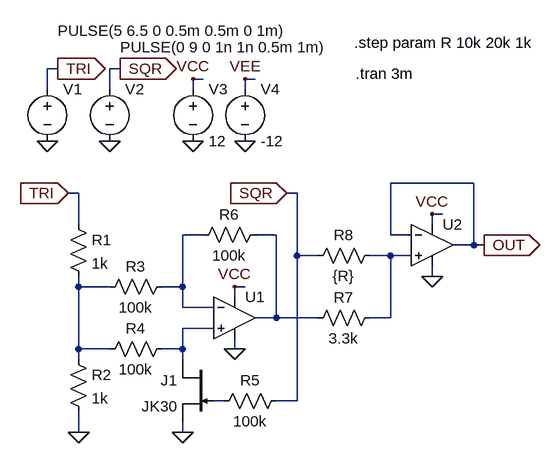
[diagram p0: schematic TRI_SQR_to_SAW_01.asc]
TRI_SQR_to_SAW_01.asc, the LTspice schematic file:
Version 4
SHEET 1 1268 680
WIRE 112 -160 96 -160
WIRE 208 -160 192 -160
WIRE 336 -144 320 -144
WIRE 416 -144 400 -144
WIRE 96 -128 96 -160
WIRE 192 -128 192 -160
WIRE 320 -128 320 -144
WIRE 400 -128 400 -144
WIRE 752 16 624 16
WIRE 144 32 128 32
WIRE 480 32 464 32
WIRE 704 64 688 64
WIRE 144 80 144 32
WIRE 688 80 688 64
WIRE 336 96 304 96
WIRE 448 96 416 96
WIRE 624 96 624 16
WIRE 656 96 624 96
WIRE 752 112 752 16
WIRE 752 112 720 112
WIRE 768 112 752 112
WIRE 480 128 480 32
WIRE 512 128 480 128
WIRE 624 128 592 128
WIRE 656 128 624 128
WIRE 688 160 688 144
WIRE 144 176 144 160
WIRE 192 176 144 176
WIRE 304 176 304 96
WIRE 304 176 272 176
WIRE 400 176 384 176
WIRE 384 192 384 176
WIRE 304 208 304 176
WIRE 352 208 304 208
WIRE 448 224 448 96
WIRE 448 224 416 224
WIRE 512 224 448 224
WIRE 624 224 624 128
WIRE 624 224 592 224
WIRE 352 240 304 240
WIRE 144 272 144 176
WIRE 192 272 144 272
WIRE 304 272 304 240
WIRE 304 272 272 272
WIRE 384 272 384 256
WIRE 144 288 144 272
WIRE 304 288 304 272
WIRE 368 352 352 352
WIRE 480 352 480 128
WIRE 480 352 448 352
WIRE 144 400 144 368
WIRE 304 400 304 384
FLAG 128 32 TRI
IOPIN 128 32 In
FLAG 144 400 0
FLAG 304 400 0
FLAG 384 176 VCC
FLAG 464 32 SQR
IOPIN 464 32 In
FLAG 768 112 OUT
IOPIN 768 112 Out
FLAG 112 -160 TRI
IOPIN 112 -160 Out
FLAG 208 -160 SQR
IOPIN 208 -160 Out
FLAG 96 -48 0
FLAG 192 -48 0
FLAG 320 -48 0
FLAG 400 -48 0
FLAG 320 -144 VCC
FLAG 400 -144 VEE
FLAG 688 64 VCC
FLAG 384 272 0
FLAG 688 160 0
SYMBOL res 128 64 R0
SYMATTR InstName R1
SYMATTR Value 1k
SYMBOL res 128 272 R0
SYMATTR InstName R2
SYMATTR Value 1k
SYMBOL res 288 160 R90
WINDOW 0 0 56 VBottom 2
WINDOW 3 32 56 VTop 2
SYMATTR InstName R3
SYMATTR Value 100k
SYMBOL res 288 256 R90
WINDOW 0 0 56 VBottom 2
WINDOW 3 32 56 VTop 2
SYMATTR InstName R4
SYMATTR Value 100k
SYMBOL Opamps\\UniversalOpamp2 384 224 R0
SYMATTR InstName U1
SYMBOL njf 352 288 M0
SYMATTR InstName J1
SYMATTR Value JK30
SYMBOL res 464 336 R90
WINDOW 0 0 56 VBottom 2
WINDOW 3 32 56 VTop 2
SYMATTR InstName R5
SYMATTR Value 100k
SYMBOL res 432 80 R90
WINDOW 0 0 56 VBottom 2
WINDOW 3 32 56 VTop 2
SYMATTR InstName R6
SYMATTR Value 100k
SYMBOL res 608 208 R90
WINDOW 0 0 56 VBottom 2
WINDOW 3 32 56 VTop 2
SYMATTR InstName R7
SYMATTR Value 3.3k
SYMBOL res 608 112 R90
WINDOW 0 0 56 VBottom 2
WINDOW 3 32 56 VTop 2
SYMATTR InstName R8
SYMATTR Value {R}
SYMBOL voltage 96 -144 R0
WINDOW 3 16 -74 Left 2
WINDOW 123 0 0 Left 2
WINDOW 39 0 0 Left 2
SYMATTR InstName V1
SYMATTR Value PULSE(5 6.5 0 0.5m 0.5m 0 1m)
SYMBOL voltage 192 -144 R0
WINDOW 3 16 -49 Left 2
WINDOW 123 0 0 Left 2
WINDOW 39 0 0 Left 2
SYMATTR InstName V2
SYMATTR Value PULSE(0 9 0 1n 1n 0.5m 1m)
SYMBOL voltage 320 -144 R0
WINDOW 123 0 0 Left 2
WINDOW 39 0 0 Left 2
SYMATTR InstName V3
SYMATTR Value 12
SYMBOL voltage 400 -144 R0
WINDOW 123 0 0 Left 2
WINDOW 39 0 0 Left 2
SYMATTR InstName V4
SYMATTR Value -12
SYMBOL Opamps\\UniversalOpamp2 688 112 R0
SYMATTR InstName U2
TEXT 570 -152 Left 2 !.tran 3m
TEXT 568 -200 Left 2 !.step param R 10k 20k 1k

The netlist it stands for:
* TRI_SQR_to_SAW_01.asc
R1 TRI N004 1k
R2 N004 0 1k
R3 N001 N004 100k
R4 N005 N004 100k
XU1 N005 N001 VCC 0 N002 level.2 Avol=1Meg GBW=10Meg Slew=10Meg ilimit=25m rail=0 Vos=0 phimargin=45 en=0 enk=0 in=0 ink=0 Rin=500Meg  ; pins IN+ IN- V+ V- OUT
J1 N005 N006 0 JK30
R5 SQR N006 100k
R6 N002 N001 100k
R7 N003 N002 3.3k
R8 N003 SQR {R}
V1 TRI 0 PULSE(5 6.5 0 0.5m 0.5m 0 1m)
V2 SQR 0 PULSE(0 9 0 1n 1n 0.5m 1m)
V3 VCC 0 12
V4 VEE 0 -12
XU2 N003 OUT VCC 0 OUT level.2 Avol=1Meg GBW=10Meg Slew=10Meg ilimit=25m rail=0 Vos=0 phimargin=45 en=0 enk=0 in=0 ink=0 Rin=500Meg  ; pins IN+ IN- V+ V- OUT
.model NJF NJF
.model PJF PJF
.lib standard.jft
.tran 3m
.step param R 10k 20k 1k
.lib UniversalOpamps2.sub
.backanno
.end